# EAGLE design 8or4 spaced (EAGLE 6.4)
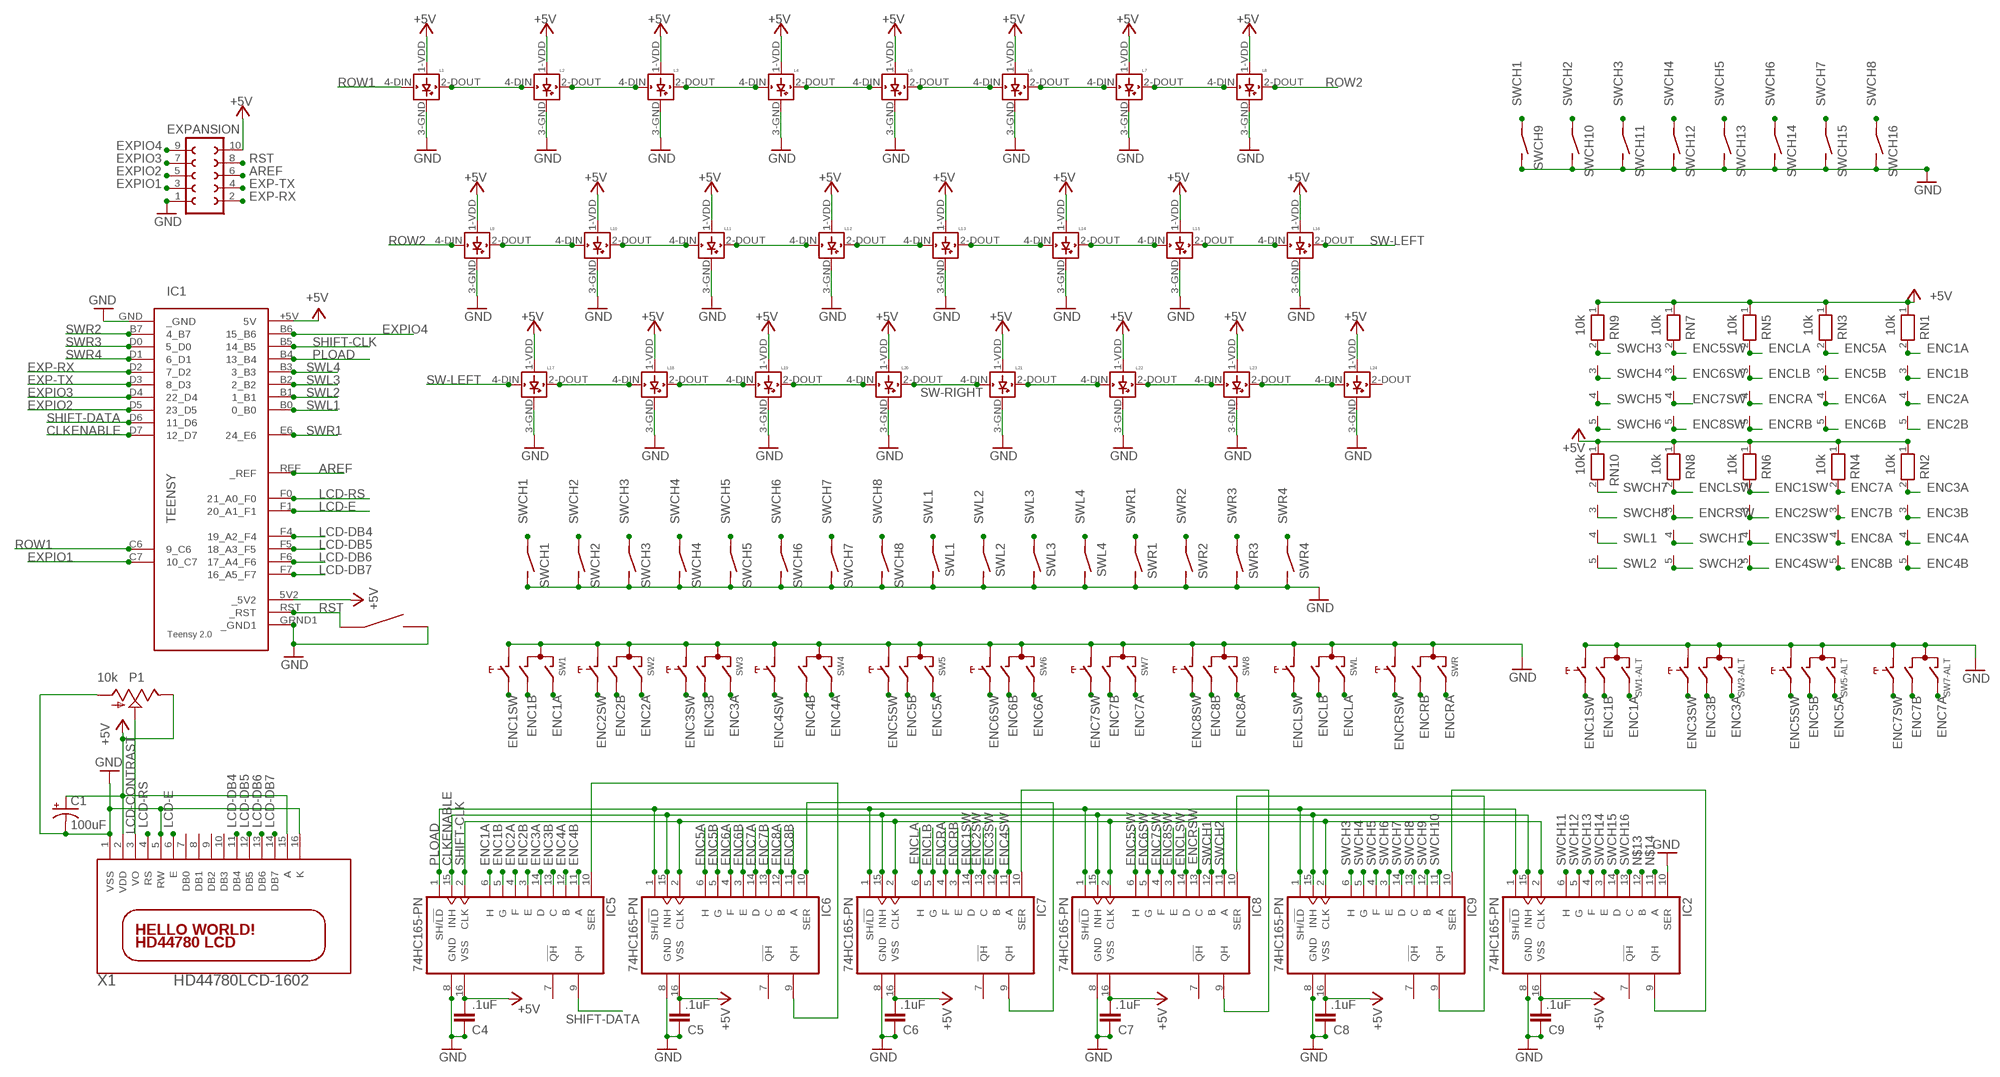
[diagram p0: schematic, sheet 1]

## Parts
C1  100uF  CPOL-USE2.5-7  [E2,5-7]
C4  .1uF  C5/3.5  [C5B3.5]
C5  .1uF  C5/3.5  [C5B3.5]
C6  .1uF  C5/3.5  [C5B3.5]
C7  .1uF  C5/3.5  [C5B3.5]
C8  .1uF  C5/3.5  [C5B3.5]
C9  .1uF  C5/3.5  [C5B3.5]
EXPANSION  FE05-2  [FE05-2]
IC1  TEENSY  [TEENSY]
IC2  74HC165-PN  [DIL16]
IC5  74HC165-PN  [DIL16]
IC6  74HC165-PN  [DIL16]
IC7  74HC165-PN  [DIL16]
IC8  74HC165-PN  [DIL16]
IC9  74HC165-PN  [DIL16]
L1  WS2812B  [WS2812B]
L2  WS2812B  [WS2812B]
L3  WS2812B  [WS2812B]
L4  WS2812B  [WS2812B]
L5  WS2812B  [WS2812B]
L6  WS2812B  [WS2812B]
L7  WS2812B  [WS2812B]
L8  WS2812B  [WS2812B]
L9  WS2812B  [WS2812B]
L10  WS2812B  [WS2812B]
L11  WS2812B  [WS2812B]
L12  WS2812B  [WS2812B]
L13  WS2812B  [WS2812B]
L14  WS2812B  [WS2812B]
L15  WS2812B  [WS2812B]
L16  WS2812B  [WS2812B]
L17  WS2812B  [WS2812B]
L18  WS2812B  [WS2812B]
L19  WS2812B  [WS2812B]
L20  WS2812B  [WS2812B]
L21  WS2812B  [WS2812B]
L22  WS2812B  [WS2812B]
L23  WS2812B  [WS2812B]
L24  WS2812B  [WS2812B]
P1  10k  TRIM_US-B25U  [B25U]
RN1  10k  RN04  [RN-5]
RN2  10k  RN04  [RN-5]
RN3  10k  RN04  [RN-5]
RN4  10k  RN04  [RN-5]
RN5  10k  RN04  [RN-5]
RN6  10k  RN04  [RN-5]
RN7  10k  RN04  [RN-5]
RN8  10k  RN04  [RN-5]
RN9  10k  RN04  [RN-5]
RN10  10k  RN04  [RN-5]
SW1  EC12E_SW  [ALPS_EC12E_SW]
SW1-ALT  EC12E_SW  [ALPS_EC12E_SW]
SW2  EC12E_SW  [ALPS_EC12E_SW]
SW3  EC12E_SW  [ALPS_EC12E_SW]
SW3-ALT  EC12E_SW  [ALPS_EC12E_SW]
SW4  EC12E_SW  [ALPS_EC12E_SW]
SW5  EC12E_SW  [ALPS_EC12E_SW]
SW5-ALT  EC12E_SW  [ALPS_EC12E_SW]
SW6  EC12E_SW  [ALPS_EC12E_SW]
SW7  EC12E_SW  [ALPS_EC12E_SW]
SW7-ALT  EC12E_SW  [ALPS_EC12E_SW]
SW8  EC12E_SW  [ALPS_EC12E_SW]
SWCH1  BPM  [BMP]
SWCH2  BPM  [BMP]
SWCH3  BPM  [BMP]
SWCH4  BPM  [BMP]
SWCH5  BPM  [BMP]
SWCH6  BPM  [BMP]
SWCH7  BPM  [BMP]
SWCH8  BPM  [BMP]
SWCH9  BPM  [BMP]
SWCH10  BPM  [BMP]
SWCH11  BPM  [BMP]
SWCH12  BPM  [BMP]
SWCH13  BPM  [BMP]
SWCH14  BPM  [BMP]
SWCH15  BPM  [BMP]
SWCH16  BPM  [BMP]
SWL  EC12E_SW  [ALPS_EC12E_SW]
SWL1  BPM  [BMP]
SWL2  BPM  [BMP]
SWL3  BPM  [BMP]
SWL4  BPM  [BMP]
SWR  EC12E_SW  [ALPS_EC12E_SW]
SWR1  BPM  [BMP]
SWR2  BPM  [BMP]
SWR3  BPM  [BMP]
SWR4  BPM  [BMP]
U$1  RA-TACT  [B3F-3100]
X1  HD44780LCD-1602  [LCD1602]

## Nets
+5V: C1.+ C4.1 C5.2 C6.2 C7.2 C8.2 C9.2 EXPANSION.10 IC1.5V2(_5V2) IC1.+5V(5V) IC2.16(VSS) IC5.16(VSS) IC6.16(VSS) IC7.16(VSS) IC8.16(VSS) IC9.16(VSS) L1.1-VDD(VDD) L2.1-VDD(VDD) L3.1-VDD(VDD) L4.1-VDD(VDD) L5.1-VDD(VDD) L6.1-VDD(VDD) L7.1-VDD(VDD) L8.1-VDD(VDD) L9.1-VDD(VDD) L10.1-VDD(VDD) L11.1-VDD(VDD) L12.1-VDD(VDD) L13.1-VDD(VDD) L14.1-VDD(VDD) L15.1-VDD(VDD) L16.1-VDD(VDD) L17.1-VDD(VDD) L18.1-VDD(VDD) L19.1-VDD(VDD) L20.1-VDD(VDD) L21.1-VDD(VDD) L22.1-VDD(VDD) L23.1-VDD(VDD) L24.1-VDD(VDD) P1.E RN1.1 RN2.1 RN3.1 RN4.1 RN5.1 RN6.1 RN7.1 RN8.1 RN9.1 RN10.1 X1.2(VDD) X1.15(A)
AREF: EXPANSION.6 IC1.REF(_REF)
CLKENABLE: IC1.D7(12_D7) IC2.15(INH) IC5.15(INH) IC6.15(INH) IC7.15(INH) IC8.15(INH) IC9.15(INH)
ENC1A: IC5.6(H) RN1.2 SW1-ALT.A SW1.A
ENC1B: IC5.5(G) RN1.3 SW1-ALT.B SW1.B
ENC1SW: IC7.14(D) RN6.2 SW1-ALT.E SW1.E
ENC2A: IC5.4(F) RN1.4 SW2.A
ENC2B: IC5.3(E) RN1.5 SW2.B
ENC2SW: IC7.13(C) RN6.3 SW2.E
ENC3A: IC5.14(D) RN2.2 SW3-ALT.A SW3.A
ENC3B: IC5.13(C) RN2.3 SW3-ALT.B SW3.B
ENC3SW: IC7.12(B) RN6.4 SW3-ALT.E SW3.E
ENC4A: IC5.12(B) RN2.4 SW4.A
ENC4B: IC5.11(A) RN2.5 SW4.B
ENC4SW: IC7.11(A) RN6.5 SW4.E
ENC5A: IC6.6(H) RN3.2 SW5-ALT.A SW5.A
ENC5B: IC6.5(G) RN3.3 SW5-ALT.B SW5.B
ENC5SW: IC8.6(H) RN7.2 SW5-ALT.E SW5.E
ENC6A: IC6.4(F) RN3.4 SW6.A
ENC6B: IC6.3(E) RN3.5 SW6.B
ENC6SW: IC8.5(G) RN7.3 SW6.E
ENC7A: IC6.14(D) RN4.2 SW7-ALT.A SW7.A
ENC7B: IC6.13(C) RN4.3 SW7-ALT.B SW7.B
ENC7SW: IC8.4(F) RN7.4 SW7-ALT.E SW7.E
ENC8A: IC6.12(B) RN4.4 SW8.A
ENC8B: IC6.11(A) RN4.5 SW8.B
ENC8SW: IC8.3(E) RN7.5 SW8.E
ENCLA: IC7.6(H) RN5.2 SWL.A
ENCLB: IC7.5(G) RN5.3 SWL.B
ENCLSW: IC8.14(D) RN8.2 SWL.E
ENCRA: IC7.4(F) RN5.4 SWR.A
ENCRB: IC7.3(E) RN5.5 SWR.B
ENCRSW: IC8.13(C) RN8.3 SWR.E
EXP-RX: EXPANSION.2 IC1.D2(7_D2)
EXP-TX: EXPANSION.4 IC1.D3(8_D3)
EXPIO1: EXPANSION.3 IC1.C7(10_C7)
EXPIO2: EXPANSION.5 IC1.D5(23_D5)
EXPIO3: EXPANSION.7 IC1.D4(22_D4)
EXPIO4: EXPANSION.9 IC1.B6(15_B6)
GND: C1.- C4.2 C5.1 C6.1 C7.1 C8.1 C9.1 EXPANSION.1 IC1.GND(_GND) IC1.GRND1(_GND1) IC2.8(GND) IC2.10(SER) IC5.8(GND) IC6.8(GND) IC7.8(GND) IC8.8(GND) IC9.8(GND) L1.3-GND(GND) L2.3-GND(GND) L3.3-GND(GND) L4.3-GND(GND) L5.3-GND(GND) L6.3-GND(GND) L7.3-GND(GND) L8.3-GND(GND) L9.3-GND(GND) L10.3-GND(GND) L11.3-GND(GND) L12.3-GND(GND) L13.3-GND(GND) L14.3-GND(GND) L15.3-GND(GND) L16.3-GND(GND) L17.3-GND(GND) L18.3-GND(GND) L19.3-GND(GND) L20.3-GND(GND) L21.3-GND(GND) L22.3-GND(GND) L23.3-GND(GND) L24.3-GND(GND) P1.A SW1-ALT.C SW1-ALT.D SW1.C SW1.D SW2.C SW2.D SW3-ALT.C SW3-ALT.D SW3.C SW3.D SW4.C SW4.D SW5-ALT.C SW5-ALT.D SW5.C SW5.D SW6.C SW6.D SW7-ALT.C SW7-ALT.D SW7.C SW7.D SW8.C SW8.D SWCH1.1 SWCH2.1 SWCH3.1 SWCH4.1 SWCH5.1 SWCH6.1 SWCH7.1 SWCH8.1 SWCH9.1 SWCH10.1 SWCH11.1 SWCH12.1 SWCH13.1 SWCH14.1 SWCH15.1 SWCH16.1 SWL1.1 SWL2.1 SWL3.1 SWL4.1 SWL.C SWL.D SWR1.1 SWR2.1 SWR3.1 SWR4.1 SWR.C SWR.D U$1.P2 X1.1(VSS) X1.5(RW) X1.16(K)
IC6-5: IC5.10(SER) IC6.9(QH)
IC7-6: IC6.10(SER) IC7.9(QH)
IC8-7: IC7.10(SER) IC8.9(QH)
IC9-8: IC8.10(SER) IC9.9(QH)
LCD-CONTRAST: P1.S X1.3(VO)
LCD-DB4: IC1.F4(19_A2_F4) X1.11(DB4)
LCD-DB5: IC1.F5(18_A3_F5) X1.12(DB5)
LCD-DB6: IC1.F6(17_A4_F6) X1.13(DB6)
LCD-DB7: IC1.F7(16_A5_F7) X1.14(DB7)
LCD-E: IC1.F1(20_A1_F1) X1.6(E)
LCD-RS: IC1.F0(21_A0_F0) X1.4(RS)
N$1: IC2.9(QH) IC9.10(SER)
N$2: L1.2-DOUT(DOUT) L2.4-DIN(DIN)
N$3: L2.2-DOUT(DOUT) L3.4-DIN(DIN)
N$4: L3.2-DOUT(DOUT) L4.4-DIN(DIN)
N$5: L4.2-DOUT(DOUT) L5.4-DIN(DIN)
N$6: L5.2-DOUT(DOUT) L6.4-DIN(DIN)
N$7: L6.2-DOUT(DOUT) L7.4-DIN(DIN)
N$8: L7.2-DOUT(DOUT) L8.4-DIN(DIN)
N$11: L9.2-DOUT(DOUT) L10.4-DIN(DIN)
N$12: L10.2-DOUT(DOUT) L11.4-DIN(DIN)
N$13: IC2.12(B)
N$14: IC2.11(A)
N$15: L11.2-DOUT(DOUT) L12.4-DIN(DIN)
N$16: L12.2-DOUT(DOUT) L13.4-DIN(DIN)
N$17: L13.2-DOUT(DOUT) L14.4-DIN(DIN)
N$18: L14.2-DOUT(DOUT) L15.4-DIN(DIN)
N$19: L15.2-DOUT(DOUT) L16.4-DIN(DIN)
N$22: L17.2-DOUT(DOUT) L18.4-DIN(DIN)
N$23: L18.2-DOUT(DOUT) L19.4-DIN(DIN)
N$24: L19.2-DOUT(DOUT) L20.4-DIN(DIN)
N$26: L21.2-DOUT(DOUT) L22.4-DIN(DIN)
N$27: L22.2-DOUT(DOUT) L23.4-DIN(DIN)
N$28: L23.2-DOUT(DOUT) L24.4-DIN(DIN)
PLOAD: IC1.B4(13_B4) IC2.1(SH/!LD) IC5.1(SH/!LD) IC6.1(SH/!LD) IC7.1(SH/!LD) IC8.1(SH/!LD) IC9.1(SH/!LD)
ROW1: IC1.C6(9_C6) L1.4-DIN(DIN)
ROW2: L8.2-DOUT(DOUT) L9.4-DIN(DIN)
RST: EXPANSION.8 IC1.RST(_RST) U$1.P1
SHIFT-CLK: IC1.B5(14_B5) IC2.2(CLK) IC5.2(CLK) IC6.2(CLK) IC7.2(CLK) IC8.2(CLK) IC9.2(CLK)
SHIFT-DATA: IC1.D6(11_D6) IC5.9(QH)
SW-LEFT: L16.2-DOUT(DOUT) L17.4-DIN(DIN)
SW-RIGHT: L20.2-DOUT(DOUT) L21.4-DIN(DIN)
SWCH1: IC8.12(B) RN8.4 SWCH1.2 SWCH9.2
SWCH2: IC8.11(A) RN8.5 SWCH2.2 SWCH10.2
SWCH3: IC9.6(H) RN9.2 SWCH3.2 SWCH11.2
SWCH4: IC9.5(G) RN9.3 SWCH4.2 SWCH12.2
SWCH5: IC9.4(F) RN9.4 SWCH5.2 SWCH13.2
SWCH6: IC9.3(E) RN9.5 SWCH6.2 SWCH14.2
SWCH7: IC9.14(D) RN10.2 SWCH7.2 SWCH15.2
SWCH8: IC9.13(C) RN10.3 SWCH8.2 SWCH16.2
SWCH9: IC9.12(B)
SWCH10: IC9.11(A)
SWCH11: IC2.6(H)
SWCH12: IC2.5(G)
SWCH13: IC2.4(F)
SWCH14: IC2.3(E)
SWCH15: IC2.14(D)
SWCH16: IC2.13(C)
SWL1: IC1.B0(0_B0) RN10.4 SWL1.2
SWL2: IC1.B1(1_B1) RN10.5 SWL2.2
SWL3: IC1.B2(2_B2) SWL3.2
SWL4: IC1.B3(3_B3) SWL4.2
SWR1: IC1.E6(24_E6) SWR1.2
SWR2: IC1.B7(4_B7) SWR2.2
SWR3: IC1.D0(5_D0) SWR3.2
SWR4: IC1.D1(6_D1) SWR4.2
Unconnected: IC2.7(!QH) IC5.7(!QH) IC6.7(!QH) IC7.7(!QH) IC8.7(!QH) IC9.7(!QH) L24.2-DOUT(DOUT) SW1-ALT.GND1(G) SW1-ALT.GND2(G) SW1.GND1(G) SW1.GND2(G) SW2.GND1(G) SW2.GND2(G) SW3-ALT.GND1(G) SW3-ALT.GND2(G) SW3.GND1(G) SW3.GND2(G) SW4.GND1(G) SW4.GND2(G) SW5-ALT.GND1(G) SW5-ALT.GND2(G) SW5.GND1(G) SW5.GND2(G) SW6.GND1(G) SW6.GND2(G) SW7-ALT.GND1(G) SW7-ALT.GND2(G) SW7.GND1(G) SW7.GND2(G) SW8.GND1(G) SW8.GND2(G) SWL.GND1(G) SWL.GND2(G) SWR.GND1(G) SWR.GND2(G) X1.7(DB0) X1.8(DB1) X1.9(DB2) X1.10(DB3)

## Library data of the parts
C1 = rcl:CPOL-US: POLARIZED CAPACITOR, American symbol
C4-C9 = capacitor-wima:C: CAPACITOR naming: grid - package width
EXPANSION = con-lsta:FE05-2: FEMALE HEADER; OC_FARNELL: unknown; OC_NEWARK: unknown
IC1 = teensy:TEENSY: Teensy 2.0 Original Design by Clint Fisher Modified Design by Tamir Emran Licensed Under Creative Commons Attribution-ShareAlike 3.0 Unported (CC BY-SA 3.0)
IC2 IC5-IC9 = 74xx-us:74*165-P: 8-bit parallel load SHIFT REGISTER; PWR: 1
L1-L24 = adafruit:WS2812B
P1 = pot:TRIM_US-: POTENTIOMETER
RN1-RN10 = resistor-net:RN04: RESISTOR NETWORK; OC_FARNELL: unknown; OC_NEWARK: unknown
SW1 SW1-ALT SW2 SW3 SW3-ALT SW4 SW5 SW5-ALT SW6 SW7 SW7-ALT SW8 SWL SWR = switch-alps:EC12E_SW: ALPS rotary Encoder EC12E series with switch; MPN: EC12E2424407; OC_FARNELL: 1520813; OC_NEWARK: 74M1068
SWCH1-SWCH16 SWL1-SWL4 SWR1-SWR4 = livid:BPM
U$1 = omron:RA-TACT
X1 = adafruit:HD44780LCD: HD44780 LCD Standard character type LCDs, available in sizes from 8x1 to 40x4!

## Board
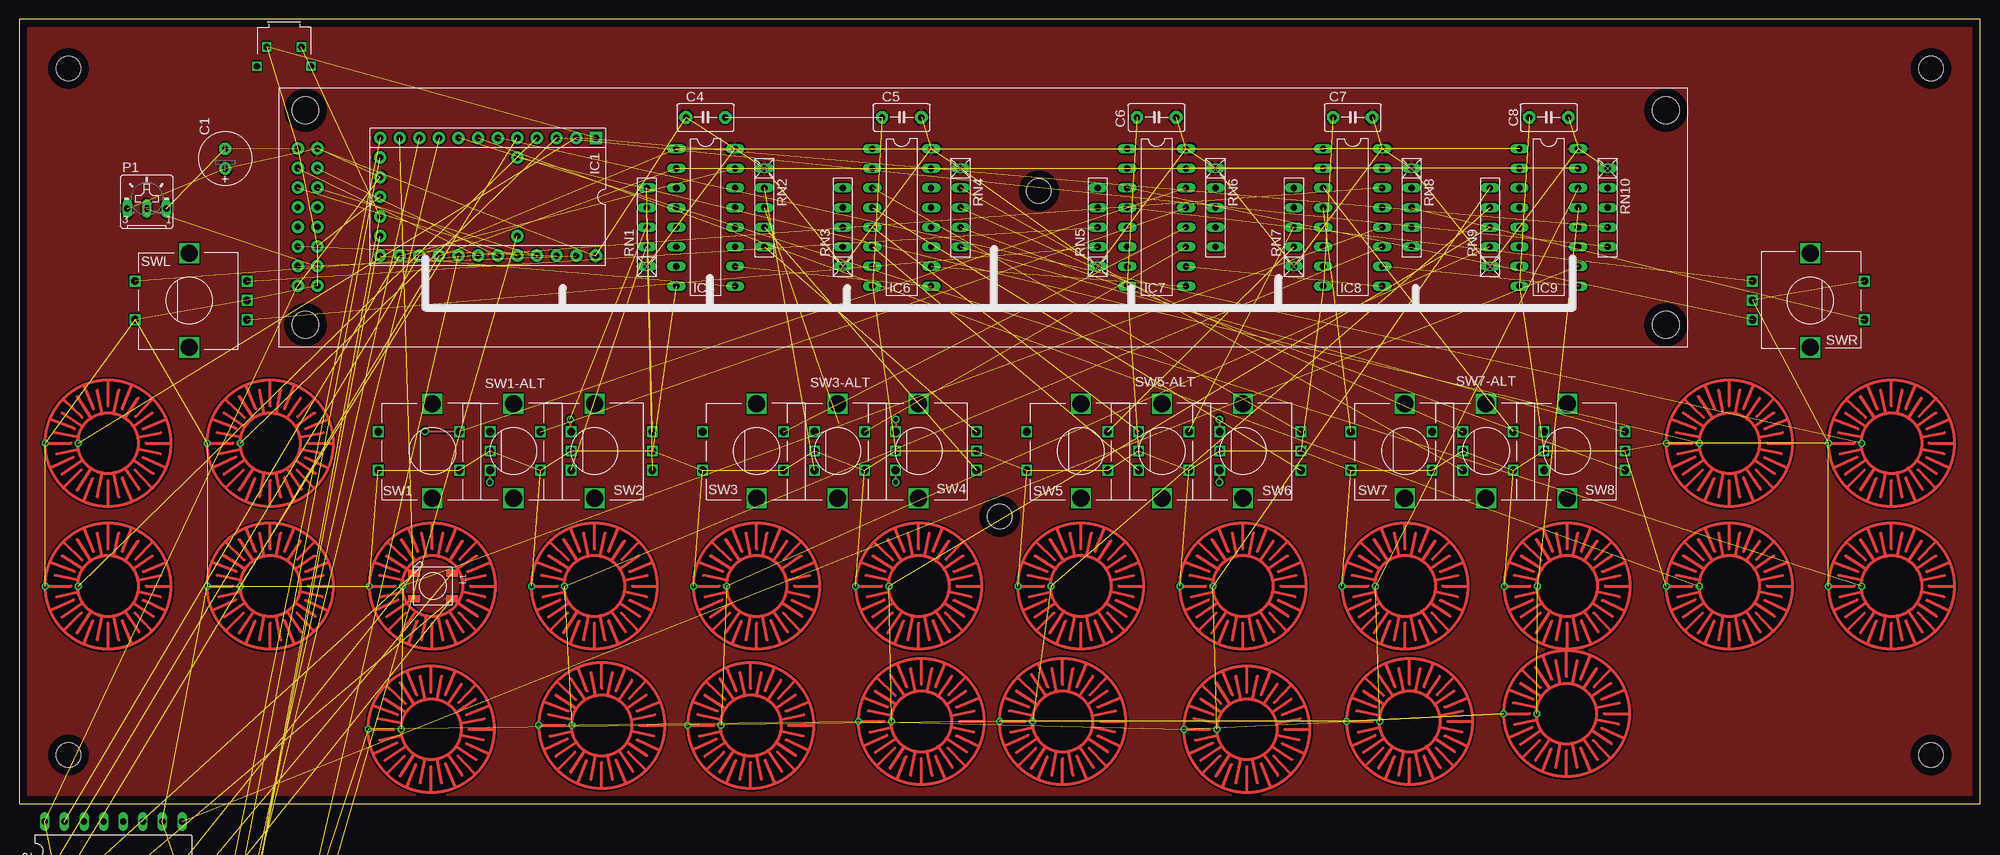
[diagram p1: board, top side]
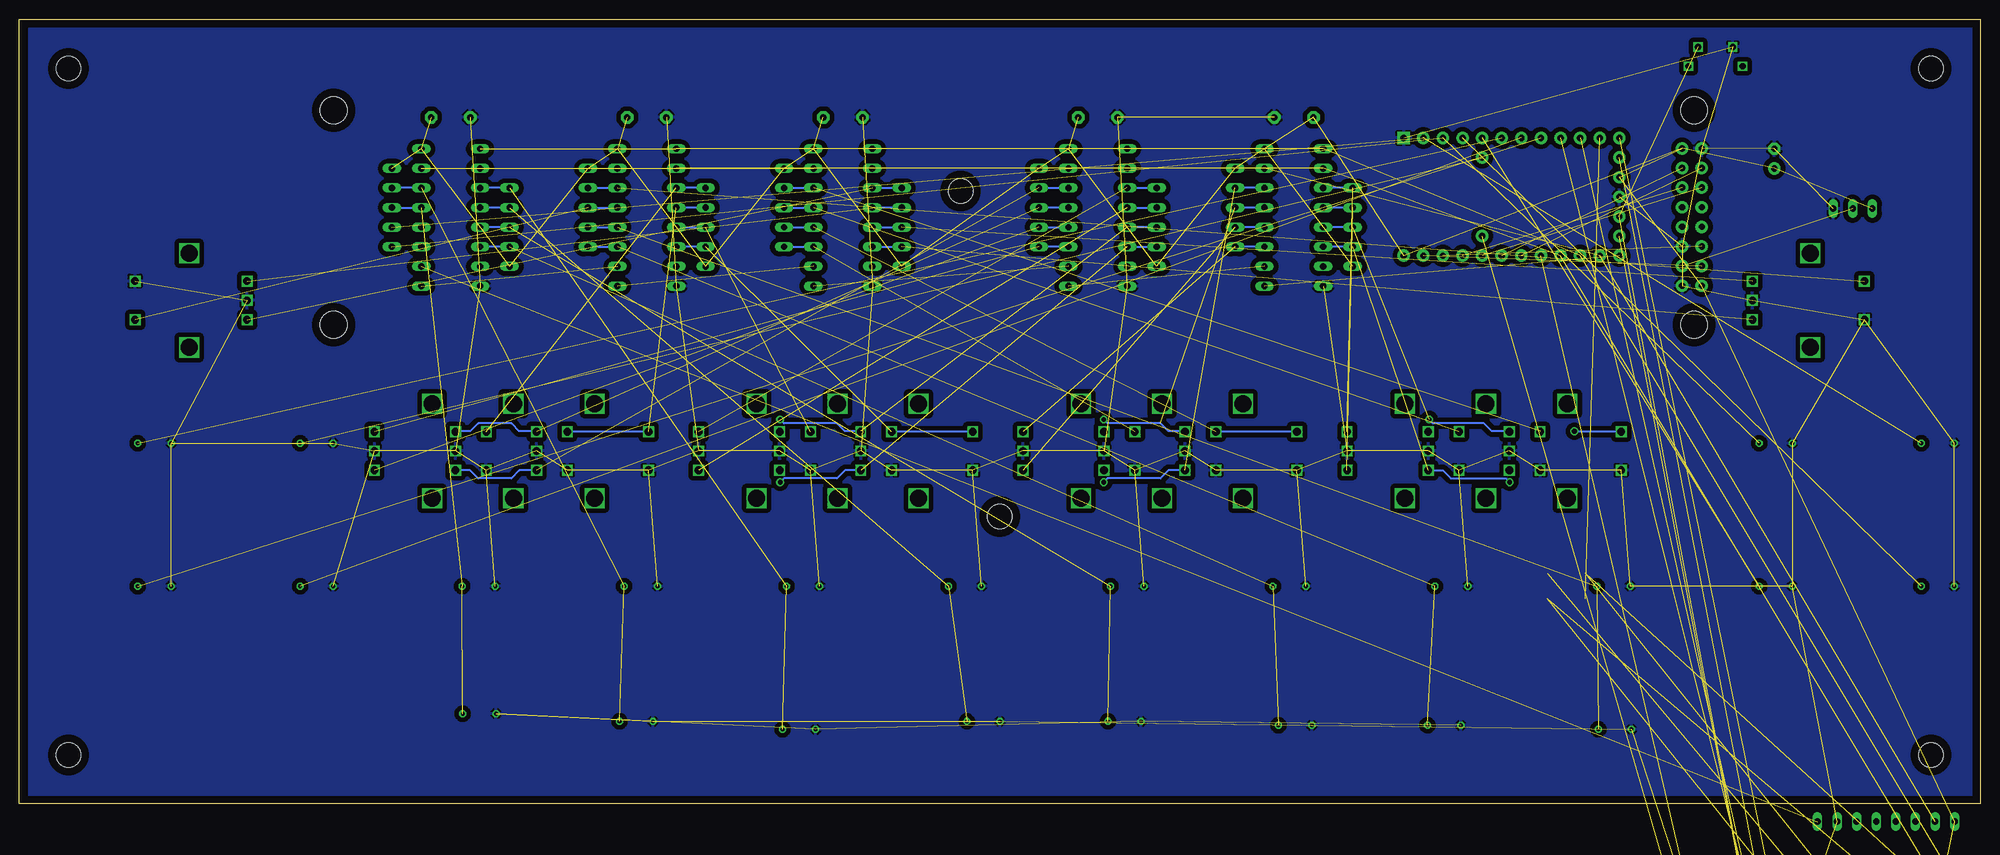
[diagram p2: board, bottom side, seen from below]

Size 254 x 101.6 mm. Coordinates in mm from the lower left corner, seen from the top.
Outline: 0,0 254,0 254,101.6 0,101.6 0,0
Copper layers (1*16): Top 0.035mm / dielectric 1.5mm / Bottom 0.035mm
Design rules "default *": minimum track width 10mil, minimum drill 8mil, track to track 8mil, track to pad 8mil, pad to pad 8mil, via to via 8mil, smd to smd 8mil, copper to edge 40mil, drill to drill 8mil, minimum pad ring 8mil, minimum via ring 8mil, stop-mask expansion 4mil, vias tented up to drill 0mil, thermal gap 10mil
Holes 3.2 mm at 6.35,95.25 6.35,6.35 247.65,6.35 247.65,95.25 132.08,79.38 127,37.21

### Footprints (pad centres in the part's own frame; a part is rotated, then mirrored left to right if it is on the bottom)
E2,5-7 = drill 0.813 pad 1.6: + -1.27,0 | drill 0.813 pad 1.6 octagon: - 1.27,0
C5B3.5 = drill 0.813 pad 1.6 octagon: 1 -2.54,0; 2 2.54,0
FE05-2 = drill 0.914: 1 -5.08,1.27 | drill 0.914 octagon: 2 -5.08,-1.27; 3 -2.54,1.27; 4 -2.54,-1.27; 5 0,1.27; 6 0,-1.27; 7 2.54,1.27; 8 2.54,-1.27; 9 5.08,1.27; 10 5.08,-1.27
TEENSY = drill 0.813 pad 1.6: 5V2 13.97,-2.54; +5V -13.97,7.62; B0 -11.43,-7.62; B1 -8.89,-7.62; B2 -6.35,-7.62; B3 -3.81,-7.62; B4 8.89,7.62; B5 6.35,7.62; B6 3.81,7.62; B7 -1.27,-7.62; C6 11.43,-7.62; C7 13.97,-7.62; D0 1.27,-7.62; D1 3.81,-7.62; D2 6.35,-7.62; D3 8.89,-7.62; D4 13.97,5.08; D5 13.97,-5.08; D6 13.97,7.62; D7 11.43,7.62; E6 -3.81,-5.08; F0 -11.43,7.62; F1 -8.89,7.62; F4 -6.35,7.62; F5 -3.81,7.62; F6 -1.27,7.62; F7 1.27,7.62; GRND1 13.97,0; REF -3.81,5.08; RST 13.97,2.54 | drill 0.813 pad 1.6 square: GND -13.97,-7.62
DIL16 = drill 0.813 long: 1 -8.89,-3.81; 2 -6.35,-3.81; 3 -3.81,-3.81; 4 -1.27,-3.81; 5 1.27,-3.81; 6 3.81,-3.81; 7 6.35,-3.81; 8 8.89,-3.81; 9 8.89,3.81; 10 6.35,3.81; 11 3.81,3.81; 12 1.27,3.81; 13 -1.27,3.81; 14 -3.81,3.81; 15 -6.35,3.81; 16 -8.89,3.81
WS2812B = smd 1.5 x 0.9: 1-VDD 2.45,-1.65; 2-DOUT 2.45,1.65; 3-GND -2.45,1.65; 4-DIN -2.45,-1.65
B25U = drill 0.813 long: A 2.54,-0.889; E -2.54,-0.889; S 0,-0.889
RN-5 = drill 0.813 long: 1 -5.08,0; 2 -2.54,0; 3 0,0; 4 2.54,0; 5 5.08,0
ALPS_EC12E_SW = drill 1 square: A -2.5,-7.5; B 2.5,-7.5; C 0,-7.5; D -2.5,7; E 2.5,7 | drill 2.2 square: GND1 -6.1,0; GND2 6.1,0
BMP = drill 0.5 pad 0.813 octagon: 1 -8.159,0; 2 -3.858,0
B3F-3100 = drill 0.8 square: N/C -3.5,2.52; N/C2 3.5,2.52; P1 -2.25,0.02; P2 2.25,0.02
LCD1602 = drill 0.813 pad 1.6: 1 5.04,7.92; 2 2.5,7.92; 3 5.04,10.46; 4 2.5,10.46; 5 5.04,13; 6 2.5,13; 7 5.04,15.54; 8 2.5,15.54; 9 5.04,18.08; 10 2.5,18.08; 11 5.04,20.62; 12 2.5,20.62; 13 5.04,23.16; 14 2.5,23.16; 15 5.04,25.7; 16 2.5,25.7 | hole 3.5: 3.5,2.86; 3.5,30.64; 179.713,30.64; 179.713,2.86

### Placement (x,y rotation side)
C1  26.67,83.57 90 top
C4  88.9,88.9 0 top
C5  114.3,88.9 0 top
C6  147.32,88.9 0 top
C7  172.72,88.9 0 top
C8  198.12,88.9 0 top
C9  3.56,-15.75 0 top  (outside the outline)
EXPANSION  6.86,-124.21 0 top  (outside the outline)
IC1  60.71,78.61 180 top
IC2  12.19,-6.1 0 top
IC5  88.9,75.95 270 top
IC6  114.3,75.95 270 top
IC7  147.32,75.95 270 top
IC8  172.72,75.95 270 top
IC9  198.12,75.95 270 top
L1  53.59,28.19 0 top
L2  3.3,-34.54 0 top  (outside the outline)
L3  3.3,-40.39 0 top  (outside the outline)
L4  3.3,-46.23 0 top  (outside the outline)
L5  3.3,-52.07 0 top  (outside the outline)
L6  3.3,-57.91 0 top  (outside the outline)
L7  3.3,-63.75 0 top  (outside the outline)
L8  3.3,-69.6 0 top  (outside the outline)
L9  3.3,-75.44 0 top  (outside the outline)
L10  11.43,-75.44 0 top  (outside the outline)
L11  3.3,-81.28 0 top  (outside the outline)
L12  11.43,-81.28 0 top  (outside the outline)
L13  3.3,-87.12 0 top  (outside the outline)
L14  11.43,-87.12 0 top  (outside the outline)
L15  3.3,-92.96 0 top  (outside the outline)
L16  11.43,-92.96 0 top  (outside the outline)
L17  3.3,-98.81 0 top  (outside the outline)
L18  11.43,-98.81 0 top  (outside the outline)
L19  3.3,-104.65 0 top  (outside the outline)
L20  11.43,-104.65 0 top  (outside the outline)
L21  3.3,-110.49 0 top  (outside the outline)
L22  11.43,-110.49 0 top  (outside the outline)
L23  3.3,-116.33 0 top  (outside the outline)
L24  11.43,-116.33 0 top  (outside the outline)
P1  16.51,77.98 0 top
RN1  81.28,74.68 90 top
RN2  96.52,77.22 270 top
RN3  106.68,74.68 90 top
RN4  121.92,77.22 270 top
RN5  139.7,74.68 90 top
RN6  154.94,77.22 270 top
RN7  165.1,74.68 90 top
RN8  180.34,77.22 270 top
RN9  190.5,74.68 90 top
RN10  205.74,77.22 270 top
SW1  53.5,45.7 90 top
SW1-ALT  64,45.7 90 top
SW2  74.5,45.7 90 top
SW3  95.5,45.7 90 top
SW3-ALT  106,45.7 90 top
SW4  116.5,45.7 90 top
SW5  137.5,45.7 90 top
SW5-ALT  148,45.7 90 top
SW6  158.5,45.7 90 top
SW7  179.5,45.7 90 top
SW7-ALT  190,45.7 90 top
SW8  200.5,45.7 90 top
SWCH1  53.5,28.2 0 top
SWCH2  74.5,28.2 0 top
SWCH3  95.5,28.2 0 top
SWCH4  116.5,28.2 0 top
SWCH5  137.5,28.2 0 top
SWCH6  158.5,28.2 0 top
SWCH7  179.5,28.2 0 top
SWCH8  200.5,28.2 0 top
SWCH9  53.34,9.65 0 top
SWCH10  75.44,10.16 0 top
SWCH11  94.74,10.16 0 top
SWCH12  116.84,10.67 0 top
SWCH13  135.13,10.67 0 top
SWCH14  159,9.65 0 top
SWCH15  180.09,10.67 0 top
SWCH16  200.41,11.68 0 top
SWL  22,65.2 90 top
SWL1  11.5,46.7 0 top
SWL2  32.5,46.7 0 top
SWL3  11.5,28.2 0 top
SWL4  32.5,28.2 0 top
SWR  232,65.2 270 top
SWR1  221.5,46.7 0 top
SWR2  242.5,46.7 0 top
SWR3  221.5,28.2 0 top
SWR4  242.5,28.2 0 top
U$1  34.29,98.04 180 top
X1  33.57,59.18 0 top

### Tracks (layer width: path | path; a pad name or v marks a point on that pad's centre or on a via)
+5V  (52 unrouted)
  pour Top: 0,101.4 253.7,101.4 253.7,1 0,1
AREF  (1 unrouted)
CLKENABLE  (6 unrouted)
ENC1A  (via drill 0.6)  (1 unrouted)
  Top 0.254: v60.96,41.66 60.96,43.18 SW1.A
  Bottom 0.254: RN1.2 IC5.6 | v60.96,41.66 61.47,42.16 68.58,42.16 69.6,43.18 71.37,43.18 SW1-ALT.A
ENC1B  (via drill 0.6)  (1 unrouted)
  Top 0.254: v71.37,49.78 71.37,48.26 SW1-ALT.B
  Bottom 0.254: RN1.3 IC5.5 | v71.37,49.78 70.87,49.28 64.26,49.28 63.25,48.26 61.21,48.26 SW1.B
ENC1SW  (via drill 0.6)  (1 unrouted)
  Top 0.254: v52.58,48.26 57,48.26 SW1-ALT.E
  Bottom 0.254: RN6.2 IC7.14 | SW1.E 52.07,48.2 v52.58,48.26
ENC2A  (1 unrouted)
  Bottom 0.254: RN1.4 IC5.4
ENC2B  (1 unrouted)
  Bottom 0.254: RN1.5 IC5.3
ENC2SW  (1 unrouted)
  Bottom 0.254: RN6.3 IC7.13
ENC3A  (via drill 0.6)  (1 unrouted)
  Top 0.254: v113.54,41.66 113.54,43.18 SW3-ALT.A
  Bottom 0.254: IC5.14 RN2.2 | v113.54,41.66 113.03,42.16 106.17,42.16 105.16,43.18 103.12,43.18 SW3.A
ENC3B  (via drill 0.6)  (1 unrouted)
  Top 0.254: v113.54,49.78 113.54,48.26 SW3-ALT.B
  Bottom 0.254: IC5.13 RN2.3 | v113.54,49.78 113.03,49.28 106.17,49.28 105.16,48.26 103.12,48.26 SW3.B
ENC3SW  (1 unrouted)
  Bottom 0.254: RN6.4 IC7.12 | SW3.E SW3-ALT.E
ENC4A  (1 unrouted)
  Bottom 0.254: IC5.12 RN2.4
ENC4B  (1 unrouted)
  Bottom 0.254: IC5.11 RN2.5
ENC4SW  (1 unrouted)
  Bottom 0.254: RN6.5 IC7.11
ENC5A  (via drill 0.6)  (1 unrouted)
  Top 0.254: v155.45,41.66 155.45,43.18 SW5-ALT.A
  Bottom 0.254: IC6.6 RN3.2 | v155.45,41.66 154.94,42.16 148.08,42.16 147.07,43.18 145.03,43.18 SW5.A
ENC5B  (via drill 0.6)  (1 unrouted)
  Top 0.254: v155.45,49.78 155.45,48.26 SW5-ALT.B
  Bottom 0.254: RN3.3 IC6.5 | v155.45,49.78 154.94,49.28 148.08,49.28 147.07,48.26 145.03,48.26 SW5.B
ENC5SW  (1 unrouted)
  Bottom 0.254: RN7.2 IC8.6 | SW5.E SW5-ALT.E
ENC6A  (1 unrouted)
  Bottom 0.254: IC6.4 RN3.4
ENC6B  (1 unrouted)
  Bottom 0.254: IC6.3 RN3.5
ENC6SW  (1 unrouted)
  Bottom 0.254: IC8.5 RN7.3
ENC7A  (1 unrouted)
  Bottom 0.254: RN4.2 IC6.14 | SW7-ALT.A 197.36,43.18 195.58,43.18 194.56,42.16 190.25,42.16 189.23,43.18 187.2,43.18 SW7.A
ENC7B  (1 unrouted)
  Bottom 0.254: IC6.13 RN4.3 | SW7-ALT.B 197.36,48.26 195.58,48.26 194.56,49.28 190.25,49.28 189.23,48.26 187.2,48.26 SW7.B
ENC7SW  (1 unrouted)
  Bottom 0.254: RN7.4 IC8.4 | SW7.E SW7-ALT.E
ENC8A  (1 unrouted)
  Bottom 0.254: RN4.4 IC6.12
ENC8B  (1 unrouted)
  Bottom 0.254: IC6.11 RN4.5
ENC8SW  (1 unrouted)
  Bottom 0.254: RN7.5 IC8.3
ENCLA  (1 unrouted)
  Bottom 0.254: IC7.6 RN5.2
ENCLB  (1 unrouted)
  Bottom 0.254: IC7.5 RN5.3
ENCLSW  (1 unrouted)
  Bottom 0.254: RN8.2 IC8.14
ENCRA  (1 unrouted)
  Bottom 0.254: RN5.4 IC7.4
ENCRB  (1 unrouted)
  Bottom 0.254: IC7.3 RN5.5
ENCRSW  (1 unrouted)
  Bottom 0.254: RN8.3 IC8.13
EXP-RX  (1 unrouted)
EXP-TX  (1 unrouted)
EXPIO1  (1 unrouted)
EXPIO2  (1 unrouted)
EXPIO3  (1 unrouted)
EXPIO4  (1 unrouted)
GND  (97 unrouted)
  pour Bottom (isolate 0.61): 1,100.4 252.7,100.4 252.7,1 1,1
IC6-5  (1 unrouted)
IC7-6  (1 unrouted)
IC8-7  (1 unrouted)
IC9-8  (1 unrouted)
LCD-CONTRAST  (1 unrouted)
LCD-DB4  (1 unrouted)
LCD-DB5  (1 unrouted)
LCD-DB6  (1 unrouted)
LCD-DB7  (1 unrouted)
LCD-E  (1 unrouted)
LCD-RS  (1 unrouted)
N$1  (1 unrouted)
N$2  (1 unrouted)
N$3  (1 unrouted)
N$4  (1 unrouted)
N$5  (1 unrouted)
N$6  (1 unrouted)
N$7  (1 unrouted)
N$8  (1 unrouted)
N$11  (1 unrouted)
N$12  (1 unrouted)
N$15  (1 unrouted)
N$16  (1 unrouted)
N$17  (1 unrouted)
N$18  (1 unrouted)
N$19  (1 unrouted)
N$22  (1 unrouted)
N$23  (1 unrouted)
N$24  (1 unrouted)
N$26  (1 unrouted)
N$27  (1 unrouted)
N$28  (1 unrouted)
PLOAD  (6 unrouted)
ROW1  (1 unrouted)
ROW2  (1 unrouted)
RST  (2 unrouted)
SHIFT-CLK  (6 unrouted)
SHIFT-DATA  (1 unrouted)
SW-LEFT  (1 unrouted)
SW-RIGHT  (1 unrouted)
SWCH1  (2 unrouted)
  Bottom 0.254: RN8.4 IC8.12
SWCH2  (2 unrouted)
  Bottom 0.254: RN8.5 IC8.11
SWCH3  (2 unrouted)
  Bottom 0.254: RN9.2 IC9.6
SWCH4  (2 unrouted)
  Bottom 0.254: RN9.3 IC9.5
SWCH5  (2 unrouted)
  Bottom 0.254: RN9.4 IC9.4
SWCH6  (2 unrouted)
  Bottom 0.254: RN9.5 IC9.3
SWCH7  (2 unrouted)
  Bottom 0.254: IC9.14 RN10.2
SWCH8  (2 unrouted)
  Bottom 0.254: RN10.3 IC9.13
SWL1  (2 unrouted)
SWL2  (2 unrouted)
SWL3  (1 unrouted)
SWL4  (1 unrouted)
SWR1  (1 unrouted)
SWR2  (1 unrouted)
SWR3  (1 unrouted)
SWR4  (1 unrouted)